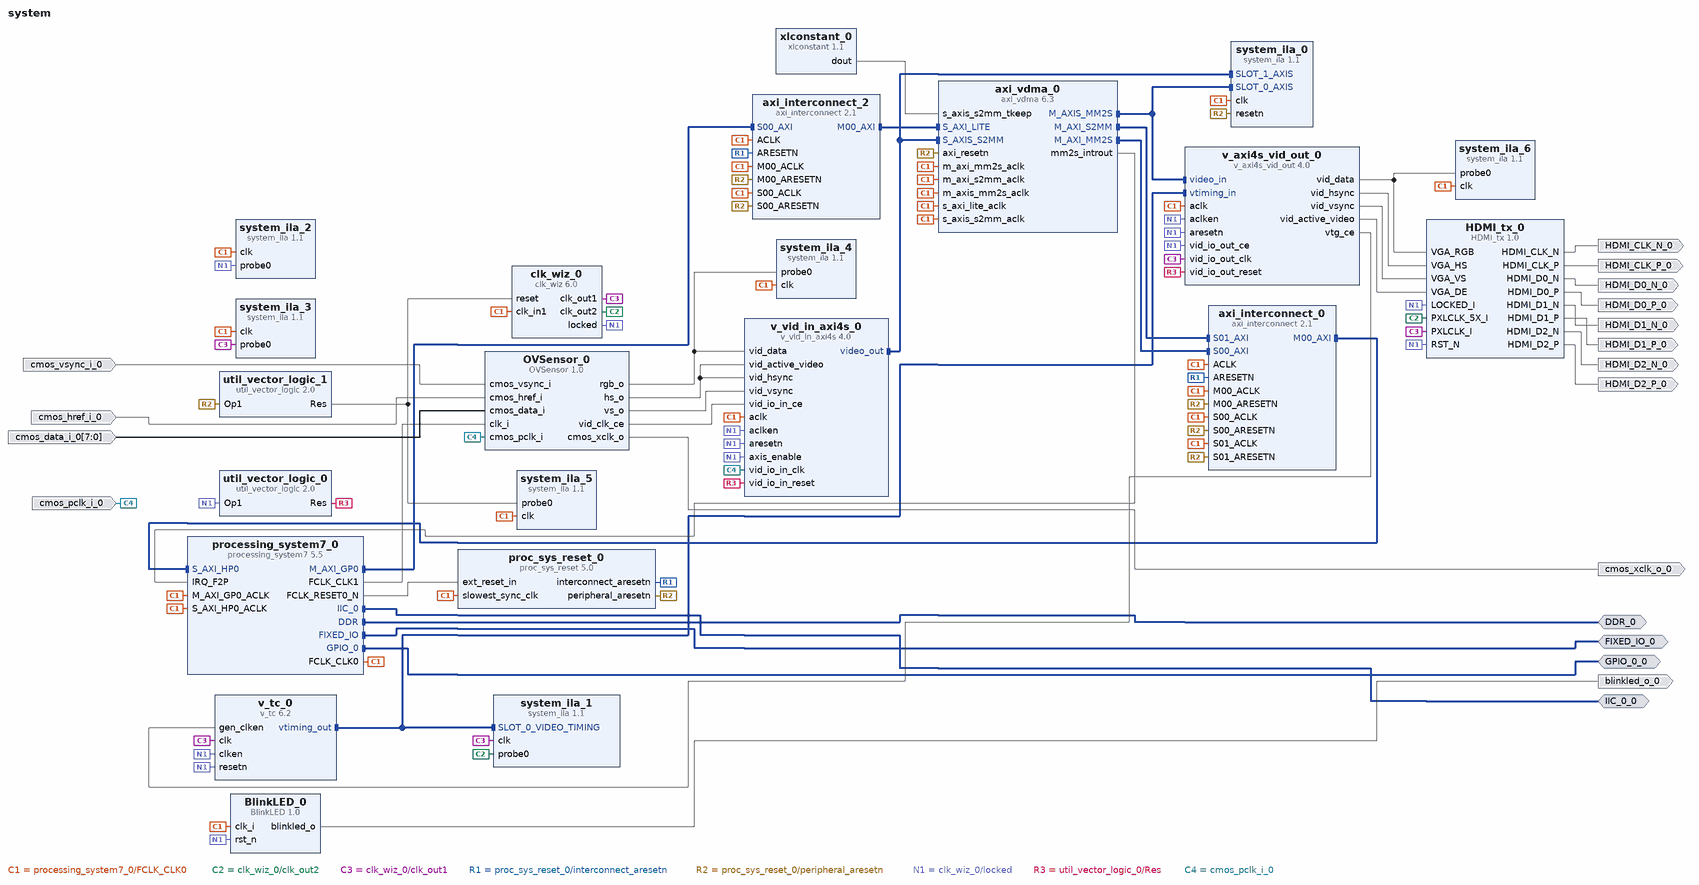
[diagram p0: block diagram of the top level]
# Vivado block design system, xc7z020clg400-2, Vivado 2019.2
create_bd_design system

create_bd_intf_port -mode Master -vlnv xilinx.com:interface:ddrx_rtl:1.0 DDR_0
create_bd_intf_port -mode Master -vlnv xilinx.com:interface:iic_rtl:1.0 IIC_0_0
create_bd_intf_port -mode Master -vlnv xilinx.com:display_processing_system7:fixedio_rtl:1.0 FIXED_IO_0
create_bd_intf_port -mode Master -vlnv xilinx.com:interface:gpio_rtl:1.0 GPIO_0_0
create_bd_port -dir I cmos_vsync_i_0
create_bd_port -dir I cmos_href_i_0
create_bd_port -dir I -from 7 -to 0 cmos_data_i_0
create_bd_port -dir O cmos_xclk_o_0
create_bd_port -dir I cmos_pclk_i_0
create_bd_port -dir O -type clk HDMI_CLK_P_0
create_bd_port -dir O HDMI_D2_P_0
create_bd_port -dir O HDMI_D2_N_0
create_bd_port -dir O HDMI_D1_P_0
create_bd_port -dir O HDMI_D1_N_0
create_bd_port -dir O HDMI_D0_P_0
create_bd_port -dir O HDMI_D0_N_0
create_bd_port -dir O -type clk HDMI_CLK_N_0
create_bd_port -dir O blinkled_o_0

create_bd_cell -type ip -vlnv xilinx.com:user:OVSensor:1.0 OVSensor_0
create_bd_cell -type ip -vlnv xilinx.com:ip:v_vid_in_axi4s:4.0 v_vid_in_axi4s_0
set_property -dict {CONFIG.C_HAS_ASYNC_CLK 1} [get_bd_cells v_vid_in_axi4s_0]
create_bd_cell -type ip -vlnv xilinx.com:ip:processing_system7:5.5 processing_system7_0
set_property -dict [list \
  CONFIG.PCW_CRYSTAL_PERIPHERAL_FREQMHZ 50 \
  CONFIG.PCW_ENET0_PERIPHERAL_ENABLE 0 \
  CONFIG.PCW_EN_CLK1_PORT 1 \
  CONFIG.PCW_FCLK_CLK1_BUF TRUE \
  CONFIG.PCW_FPGA0_PERIPHERAL_FREQMHZ 100 \
  CONFIG.PCW_FPGA1_PERIPHERAL_FREQMHZ 25 \
  CONFIG.PCW_FPGA_FCLK1_ENABLE 1 \
  CONFIG.PCW_GPIO_EMIO_GPIO_ENABLE 1 \
  CONFIG.PCW_GPIO_EMIO_GPIO_IO 4 \
  CONFIG.PCW_GPIO_EMIO_GPIO_WIDTH 4 \
  CONFIG.PCW_GPIO_MIO_GPIO_ENABLE 0 \
  CONFIG.PCW_I2C0_I2C0_IO EMIO \
  CONFIG.PCW_I2C0_PERIPHERAL_ENABLE 1 \
  CONFIG.PCW_I2C_PERIPHERAL_FREQMHZ 112.500000 \
  CONFIG.PCW_IRQ_F2P_INTR 1 \
  CONFIG.PCW_PRESET_BANK1_VOLTAGE {LVCMOS 1.8V} \
  CONFIG.PCW_QSPI_GRP_FBCLK_ENABLE 1 \
  CONFIG.PCW_QSPI_GRP_FBCLK_IO {MIO 8} \
  CONFIG.PCW_QSPI_GRP_SINGLE_SS_ENABLE 1 \
  CONFIG.PCW_QSPI_GRP_SINGLE_SS_IO {MIO 1 .. 6} \
  CONFIG.PCW_QSPI_PERIPHERAL_ENABLE 1 \
  CONFIG.PCW_QSPI_QSPI_IO {MIO 1 .. 6} \
  CONFIG.PCW_SD0_GRP_CD_ENABLE 0 \
  CONFIG.PCW_SD0_GRP_WP_ENABLE 0 \
  CONFIG.PCW_SD0_PERIPHERAL_ENABLE 1 \
  CONFIG.PCW_SD0_SD0_IO {MIO 40 .. 45} \
  CONFIG.PCW_SDIO_PERIPHERAL_FREQMHZ 100 \
  CONFIG.PCW_SINGLE_QSPI_DATA_MODE x4 \
  CONFIG.PCW_UART1_PERIPHERAL_ENABLE 1 \
  CONFIG.PCW_UART1_UART1_IO {MIO 48 .. 49} \
  CONFIG.PCW_UART_PERIPHERAL_FREQMHZ 100 \
  CONFIG.PCW_UIPARAM_DDR_PARTNO {MT41K256M16 RE-125} \
  CONFIG.PCW_USB0_PERIPHERAL_ENABLE 0 \
  CONFIG.PCW_USE_FABRIC_INTERRUPT 1 \
  CONFIG.PCW_USE_S_AXI_HP0 1 \
] [get_bd_cells processing_system7_0]
# 103 more settings of processing_system7_0 are not shown: defaults, MIO pin electricals, DDR timing, and values the tool derives
create_bd_cell -type ip -vlnv xilinx.com:ip:proc_sys_reset:5.0 proc_sys_reset_0
create_bd_cell -type ip -vlnv xilinx.com:ip:clk_wiz:6.0 clk_wiz_0
set_property -dict [list \
  CONFIG.CLKOUT1_JITTER 337.616 \
  CONFIG.CLKOUT1_PHASE_ERROR 322.999 \
  CONFIG.CLKOUT1_REQUESTED_OUT_FREQ 74.25 \
  CONFIG.CLKOUT2_JITTER 258.703 \
  CONFIG.CLKOUT2_PHASE_ERROR 322.999 \
  CONFIG.CLKOUT2_REQUESTED_OUT_FREQ 371.25 \
  CONFIG.CLKOUT2_USED true \
  CONFIG.MMCM_CLKFBOUT_MULT_F 37.125 \
  CONFIG.MMCM_CLKOUT0_DIVIDE_F 10.000 \
  CONFIG.MMCM_CLKOUT1_DIVIDE 2 \
  CONFIG.MMCM_DIVCLK_DIVIDE 5 \
  CONFIG.NUM_OUT_CLKS 2 \
] [get_bd_cells clk_wiz_0]
create_bd_cell -type ip -vlnv xilinx.com:ip:axi_vdma:6.3 axi_vdma_0
set_property -dict [list \
  CONFIG.c_m_axis_mm2s_tdata_width 24 \
  CONFIG.c_mm2s_genlock_mode 0 \
  CONFIG.c_s2mm_genlock_mode 1 \
] [get_bd_cells axi_vdma_0]
create_bd_cell -type ip -vlnv xilinx.com:ip:axi_interconnect:2.1 axi_interconnect_0
set_property -dict {CONFIG.NUM_MI 1 CONFIG.NUM_SI 2} [get_bd_cells axi_interconnect_0]
create_bd_cell -type ip -vlnv xilinx.com:ip:axi_interconnect:2.1 axi_interconnect_2
set_property -dict {CONFIG.NUM_MI 1} [get_bd_cells axi_interconnect_2]
create_bd_cell -type ip -vlnv xilinx.com:ip:v_axi4s_vid_out:4.0 v_axi4s_vid_out_0
set_property -dict {CONFIG.C_HAS_ASYNC_CLK 1} [get_bd_cells v_axi4s_vid_out_0]
create_bd_cell -type ip -vlnv xilinx.com:user:HDMI_tx:1.0 HDMI_tx_0
create_bd_cell -type ip -vlnv xilinx.com:ip:v_tc:6.2 v_tc_0
set_property -dict {CONFIG.HAS_AXI4_LITE false CONFIG.enable_detection false} [get_bd_cells v_tc_0]
create_bd_cell -type ip -vlnv xilinx.com:ip:util_vector_logic:2.0 util_vector_logic_0
set_property -dict {CONFIG.C_OPERATION not CONFIG.C_SIZE 1} [get_bd_cells util_vector_logic_0]
create_bd_cell -type ip -vlnv xilinx.com:ip:xlconstant:1.1 xlconstant_0
set_property -dict {CONFIG.CONST_VAL 7 CONFIG.CONST_WIDTH 3} [get_bd_cells xlconstant_0]
create_bd_cell -type ip -vlnv xilinx.com:ip:util_vector_logic:2.0 util_vector_logic_1
set_property -dict {CONFIG.C_OPERATION not CONFIG.C_SIZE 1} [get_bd_cells util_vector_logic_1]
create_bd_cell -type ip -vlnv xilinx.com:ip:system_ila:1.1 system_ila_0
set_property -dict [list \
  CONFIG.C_MON_TYPE INTERFACE \
  CONFIG.C_NUM_MONITOR_SLOTS 2 \
  CONFIG.C_SLOT_0_APC_EN 0 \
  CONFIG.C_SLOT_0_AXI_DATA_SEL 1 \
  CONFIG.C_SLOT_0_AXI_TRIG_SEL 1 \
  CONFIG.C_SLOT_0_INTF_TYPE xilinx.com:interface:axis_rtl:1.0 \
  CONFIG.C_SLOT_1_APC_EN 0 \
  CONFIG.C_SLOT_1_AXI_DATA_SEL 1 \
  CONFIG.C_SLOT_1_AXI_TRIG_SEL 1 \
  CONFIG.C_SLOT_1_INTF_TYPE xilinx.com:interface:axis_rtl:1.0 \
] [get_bd_cells system_ila_0]
create_bd_cell -type ip -vlnv xilinx.com:ip:system_ila:1.1 system_ila_1
set_property -dict [list \
  CONFIG.C_MON_TYPE MIX \
  CONFIG.C_NUM_MONITOR_SLOTS 1 \
  CONFIG.C_NUM_OF_PROBES 1 \
  CONFIG.C_PROBE0_TYPE 0 \
  CONFIG.C_SLOT_0_INTF_TYPE xilinx.com:interface:video_timing_rtl:2.0 \
  CONFIG.C_SLOT_0_TYPE 0 \
] [get_bd_cells system_ila_1]
create_bd_cell -type ip -vlnv xilinx.com:ip:system_ila:1.1 system_ila_2
set_property -dict {CONFIG.C_MON_TYPE NATIVE CONFIG.C_NUM_OF_PROBES 1 CONFIG.C_PROBE0_TYPE 0} [get_bd_cells system_ila_2]
create_bd_cell -type ip -vlnv xilinx.com:ip:system_ila:1.1 system_ila_3
set_property -dict [list \
  CONFIG.ALL_PROBE_SAME_MU_CNT 1 \
  CONFIG.C_MON_TYPE NATIVE \
  CONFIG.C_NUM_OF_PROBES 1 \
  CONFIG.C_PROBE0_MU_CNT 1 \
  CONFIG.C_PROBE0_TYPE 0 \
] [get_bd_cells system_ila_3]
create_bd_cell -type ip -vlnv xilinx.com:ip:system_ila:1.1 system_ila_4
set_property -dict {CONFIG.C_MON_TYPE NATIVE CONFIG.C_NUM_OF_PROBES 1 CONFIG.C_PROBE0_TYPE 0} [get_bd_cells system_ila_4]
create_bd_cell -type ip -vlnv xilinx.com:ip:system_ila:1.1 system_ila_5
set_property -dict {CONFIG.C_MON_TYPE NATIVE CONFIG.C_NUM_OF_PROBES 1 CONFIG.C_PROBE0_TYPE 0} [get_bd_cells system_ila_5]
create_bd_cell -type ip -vlnv xilinx.com:ip:system_ila:1.1 system_ila_6
set_property -dict {CONFIG.C_MON_TYPE NATIVE CONFIG.C_NUM_OF_PROBES 1 CONFIG.C_PROBE0_TYPE 0} [get_bd_cells system_ila_6]
create_bd_cell -type ip -vlnv LiuYang:user:BlinkLED:1.0 BlinkLED_0

# ---- connections ----

connect_bd_intf_net [get_bd_intf_ports IIC_0_0] [get_bd_intf_pins processing_system7_0/IIC_0]
connect_bd_intf_net [get_bd_intf_pins processing_system7_0/M_AXI_GP0] [get_bd_intf_pins axi_interconnect_2/S00_AXI]
connect_bd_intf_net [get_bd_intf_pins axi_vdma_0/M_AXI_S2MM] [get_bd_intf_pins axi_interconnect_0/S01_AXI]
connect_bd_intf_net [get_bd_intf_ports DDR_0] [get_bd_intf_pins processing_system7_0/DDR]
connect_bd_intf_net [get_bd_intf_pins axi_interconnect_2/M00_AXI] [get_bd_intf_pins axi_vdma_0/S_AXI_LITE]
connect_bd_intf_net [get_bd_intf_ports FIXED_IO_0] [get_bd_intf_pins processing_system7_0/FIXED_IO]
connect_bd_intf_net -intf_net v_tc_0_vtiming_out [get_bd_intf_pins v_tc_0/vtiming_out] [get_bd_intf_pins v_axi4s_vid_out_0/vtiming_in]
connect_bd_intf_net [get_bd_intf_pins v_tc_0/vtiming_out] [get_bd_intf_pins system_ila_1/SLOT_0_VIDEO_TIMING]
connect_bd_intf_net [get_bd_intf_ports GPIO_0_0] [get_bd_intf_pins processing_system7_0/GPIO_0]
connect_bd_intf_net [get_bd_intf_pins axi_interconnect_0/M00_AXI] [get_bd_intf_pins processing_system7_0/S_AXI_HP0]
connect_bd_intf_net -intf_net axi_vdma_0_M_AXIS_MM2S [get_bd_intf_pins axi_vdma_0/M_AXIS_MM2S] [get_bd_intf_pins v_axi4s_vid_out_0/video_in]
connect_bd_intf_net [get_bd_intf_pins axi_vdma_0/M_AXIS_MM2S] [get_bd_intf_pins system_ila_0/SLOT_0_AXIS]
connect_bd_intf_net [get_bd_intf_pins axi_vdma_0/M_AXI_MM2S] [get_bd_intf_pins axi_interconnect_0/S00_AXI]
connect_bd_intf_net -intf_net v_vid_in_axi4s_0_video_out [get_bd_intf_pins v_vid_in_axi4s_0/video_out] [get_bd_intf_pins axi_vdma_0/S_AXIS_S2MM]
connect_bd_intf_net [get_bd_intf_pins v_vid_in_axi4s_0/video_out] [get_bd_intf_pins system_ila_0/SLOT_1_AXIS]
connect_bd_net [get_bd_pins OVSensor_0/hs_o] [get_bd_pins v_vid_in_axi4s_0/vid_hsync] [get_bd_pins v_vid_in_axi4s_0/vid_active_video]
connect_bd_net [get_bd_pins OVSensor_0/vs_o] [get_bd_pins v_vid_in_axi4s_0/vid_vsync]
connect_bd_net -net OVSensor_0_rgb_o [get_bd_pins OVSensor_0/rgb_o] [get_bd_pins v_vid_in_axi4s_0/vid_data] [get_bd_pins system_ila_4/probe0]
connect_bd_net [get_bd_pins OVSensor_0/vid_clk_ce] [get_bd_pins v_vid_in_axi4s_0/vid_io_in_ce]
connect_bd_net -net v_axi4s_vid_out_0_vid_data [get_bd_pins v_axi4s_vid_out_0/vid_data] \
  [get_bd_pins HDMI_tx_0/VGA_RGB] [get_bd_pins system_ila_6/probe0]
connect_bd_net [get_bd_pins v_axi4s_vid_out_0/vid_hsync] [get_bd_pins HDMI_tx_0/VGA_HS]
connect_bd_net [get_bd_pins v_axi4s_vid_out_0/vid_vsync] [get_bd_pins HDMI_tx_0/VGA_VS]
connect_bd_net [get_bd_pins v_axi4s_vid_out_0/vid_active_video] [get_bd_pins HDMI_tx_0/VGA_DE]
connect_bd_net [get_bd_pins processing_system7_0/FCLK_CLK0] \
  [get_bd_pins processing_system7_0/M_AXI_GP0_ACLK] [get_bd_pins processing_system7_0/S_AXI_HP0_ACLK] \
  [get_bd_pins clk_wiz_0/clk_in1] [get_bd_pins proc_sys_reset_0/slowest_sync_clk] [get_bd_pins v_vid_in_axi4s_0/aclk] \
  [get_bd_pins axi_vdma_0/s_axi_lite_aclk] [get_bd_pins axi_vdma_0/m_axi_mm2s_aclk] [get_bd_pins axi_vdma_0/m_axis_mm2s_aclk] \
  [get_bd_pins axi_vdma_0/m_axi_s2mm_aclk] [get_bd_pins axi_vdma_0/s_axis_s2mm_aclk] [get_bd_pins axi_interconnect_0/ACLK] \
  [get_bd_pins axi_interconnect_0/S00_ACLK] [get_bd_pins axi_interconnect_0/M00_ACLK] \
  [get_bd_pins axi_interconnect_0/S01_ACLK] [get_bd_pins axi_interconnect_2/ACLK] [get_bd_pins axi_interconnect_2/S00_ACLK] \
  [get_bd_pins axi_interconnect_2/M00_ACLK] [get_bd_pins v_axi4s_vid_out_0/aclk] [get_bd_pins system_ila_0/clk] \
  [get_bd_pins system_ila_2/clk] [get_bd_pins system_ila_3/clk] [get_bd_pins system_ila_4/clk] [get_bd_pins system_ila_5/clk] \
  [get_bd_pins system_ila_6/clk] [get_bd_pins BlinkLED_0/clk_i]
connect_bd_net -net clk_wiz_0_clk_out2 [get_bd_pins clk_wiz_0/clk_out2] [get_bd_pins HDMI_tx_0/PXLCLK_5X_I] [get_bd_pins system_ila_1/probe0]
connect_bd_net -net Net1 [get_bd_pins clk_wiz_0/clk_out1] \
  [get_bd_pins HDMI_tx_0/PXLCLK_I] [get_bd_pins v_axi4s_vid_out_0/vid_io_out_clk] [get_bd_pins v_tc_0/clk] \
  [get_bd_pins system_ila_1/clk] [get_bd_pins system_ila_3/probe0]
connect_bd_net [get_bd_pins processing_system7_0/FCLK_RESET0_N] [get_bd_pins proc_sys_reset_0/ext_reset_in]
connect_bd_net [get_bd_pins proc_sys_reset_0/interconnect_aresetn] [get_bd_pins axi_interconnect_0/ARESETN] [get_bd_pins axi_interconnect_2/ARESETN]
connect_bd_net -net S00_ARESETN_1 [get_bd_pins proc_sys_reset_0/peripheral_aresetn] \
  [get_bd_pins axi_interconnect_0/S00_ARESETN] [get_bd_pins axi_interconnect_0/M00_ARESETN] \
  [get_bd_pins axi_interconnect_0/S01_ARESETN] [get_bd_pins axi_interconnect_2/S00_ARESETN] \
  [get_bd_pins axi_interconnect_2/M00_ARESETN] [get_bd_pins axi_vdma_0/axi_resetn] [get_bd_pins util_vector_logic_1/Op1] \
  [get_bd_pins system_ila_0/resetn]
connect_bd_net [get_bd_pins processing_system7_0/FCLK_CLK1] [get_bd_pins OVSensor_0/clk_i]
connect_bd_net -net cmos_vsync_i_0_1 [get_bd_ports cmos_vsync_i_0] [get_bd_pins OVSensor_0/cmos_vsync_i]
connect_bd_net -net cmos_href_i_0_1 [get_bd_ports cmos_href_i_0] [get_bd_pins OVSensor_0/cmos_href_i]
connect_bd_net -net cmos_data_i_0_1 [get_bd_ports cmos_data_i_0] [get_bd_pins OVSensor_0/cmos_data_i]
connect_bd_net [get_bd_pins OVSensor_0/cmos_xclk_o] [get_bd_ports cmos_xclk_o_0]
connect_bd_net -net clk_wiz_0_locked [get_bd_pins clk_wiz_0/locked] \
  [get_bd_pins util_vector_logic_0/Op1] [get_bd_pins v_vid_in_axi4s_0/aclken] [get_bd_pins v_vid_in_axi4s_0/axis_enable] \
  [get_bd_pins v_axi4s_vid_out_0/vid_io_out_ce] [get_bd_pins v_axi4s_vid_out_0/aclken] \
  [get_bd_pins v_axi4s_vid_out_0/aresetn] [get_bd_pins v_vid_in_axi4s_0/aresetn] [get_bd_pins v_tc_0/clken] \
  [get_bd_pins v_tc_0/resetn] [get_bd_pins HDMI_tx_0/RST_N] [get_bd_pins HDMI_tx_0/LOCKED_I] \
  [get_bd_pins system_ila_2/probe0] [get_bd_pins BlinkLED_0/rst_n]
connect_bd_net [get_bd_pins v_axi4s_vid_out_0/vtg_ce] [get_bd_pins v_tc_0/gen_clken]
connect_bd_net [get_bd_pins util_vector_logic_0/Res] [get_bd_pins v_axi4s_vid_out_0/vid_io_out_reset] [get_bd_pins v_vid_in_axi4s_0/vid_io_in_reset]
connect_bd_net -net cmos_pclk_i_0_1 [get_bd_ports cmos_pclk_i_0] [get_bd_pins OVSensor_0/cmos_pclk_i] [get_bd_pins v_vid_in_axi4s_0/vid_io_in_clk]
connect_bd_net -net util_vector_logic_1_Res [get_bd_pins util_vector_logic_1/Res] [get_bd_pins clk_wiz_0/reset] [get_bd_pins system_ila_5/probe0]
connect_bd_net [get_bd_pins xlconstant_0/dout] [get_bd_pins axi_vdma_0/s_axis_s2mm_tkeep]
connect_bd_net [get_bd_pins HDMI_tx_0/HDMI_CLK_P] [get_bd_ports HDMI_CLK_P_0]
connect_bd_net [get_bd_pins HDMI_tx_0/HDMI_D2_P] [get_bd_ports HDMI_D2_P_0]
connect_bd_net [get_bd_pins HDMI_tx_0/HDMI_D2_N] [get_bd_ports HDMI_D2_N_0]
connect_bd_net [get_bd_pins HDMI_tx_0/HDMI_D1_P] [get_bd_ports HDMI_D1_P_0]
connect_bd_net [get_bd_pins HDMI_tx_0/HDMI_D1_N] [get_bd_ports HDMI_D1_N_0]
connect_bd_net [get_bd_pins HDMI_tx_0/HDMI_D0_P] [get_bd_ports HDMI_D0_P_0]
connect_bd_net [get_bd_pins HDMI_tx_0/HDMI_D0_N] [get_bd_ports HDMI_D0_N_0]
connect_bd_net [get_bd_pins HDMI_tx_0/HDMI_CLK_N] [get_bd_ports HDMI_CLK_N_0]
connect_bd_net [get_bd_pins axi_vdma_0/mm2s_introut] [get_bd_pins processing_system7_0/IRQ_F2P]
connect_bd_net [get_bd_pins BlinkLED_0/blinkled_o] [get_bd_ports blinkled_o_0]
set_property HDL_ATTRIBUTE.DEBUG true [get_bd_intf_nets v_tc_0_vtiming_out]
set_property HDL_ATTRIBUTE.MARK_DEBUG true [get_bd_intf_nets v_tc_0_vtiming_out]
set_property HDL_ATTRIBUTE.DEBUG true [get_bd_intf_nets axi_vdma_0_M_AXIS_MM2S]
set_property HDL_ATTRIBUTE.MARK_DEBUG true [get_bd_intf_nets axi_vdma_0_M_AXIS_MM2S]
set_property HDL_ATTRIBUTE.DEBUG true [get_bd_intf_nets v_vid_in_axi4s_0_video_out]
set_property HDL_ATTRIBUTE.MARK_DEBUG true [get_bd_intf_nets v_vid_in_axi4s_0_video_out]
set_property HDL_ATTRIBUTE.DEBUG true [get_bd_nets OVSensor_0_rgb_o]
set_property HDL_ATTRIBUTE.MARK_DEBUG true [get_bd_nets OVSensor_0_rgb_o]
set_property HDL_ATTRIBUTE.DEBUG true [get_bd_nets v_axi4s_vid_out_0_vid_data]
set_property HDL_ATTRIBUTE.MARK_DEBUG true [get_bd_nets v_axi4s_vid_out_0_vid_data]
set_property HDL_ATTRIBUTE.DEBUG true [get_bd_nets clk_wiz_0_clk_out2]
set_property HDL_ATTRIBUTE.MARK_DEBUG true [get_bd_nets clk_wiz_0_clk_out2]
set_property HDL_ATTRIBUTE.DEBUG true [get_bd_nets Net1]
set_property HDL_ATTRIBUTE.MARK_DEBUG true [get_bd_nets Net1]
set_property HDL_ATTRIBUTE.DEBUG true [get_bd_nets clk_wiz_0_locked]
set_property HDL_ATTRIBUTE.MARK_DEBUG true [get_bd_nets clk_wiz_0_locked]
set_property HDL_ATTRIBUTE.DEBUG true [get_bd_nets util_vector_logic_1_Res]
set_property HDL_ATTRIBUTE.MARK_DEBUG true [get_bd_nets util_vector_logic_1_Res]

# ---- address map ----
assign_bd_address -offset 0x00000000 -range 1G -target_address_space [get_bd_addr_spaces axi_vdma_0/Data_MM2S] [get_bd_addr_segs processing_system7_0/S_AXI_HP0/HP0_DDR_LOWOCM]
assign_bd_address -offset 0x00000000 -range 1G -target_address_space [get_bd_addr_spaces axi_vdma_0/Data_S2MM] [get_bd_addr_segs processing_system7_0/S_AXI_HP0/HP0_DDR_LOWOCM]
assign_bd_address -offset 0x43000000 -range 64K -target_address_space [get_bd_addr_spaces processing_system7_0/Data] [get_bd_addr_segs axi_vdma_0/S_AXI_LITE/Reg]

validate_bd_design
save_bd_design
